# Altium schematic sheet water_system_module.SchDoc
size A4
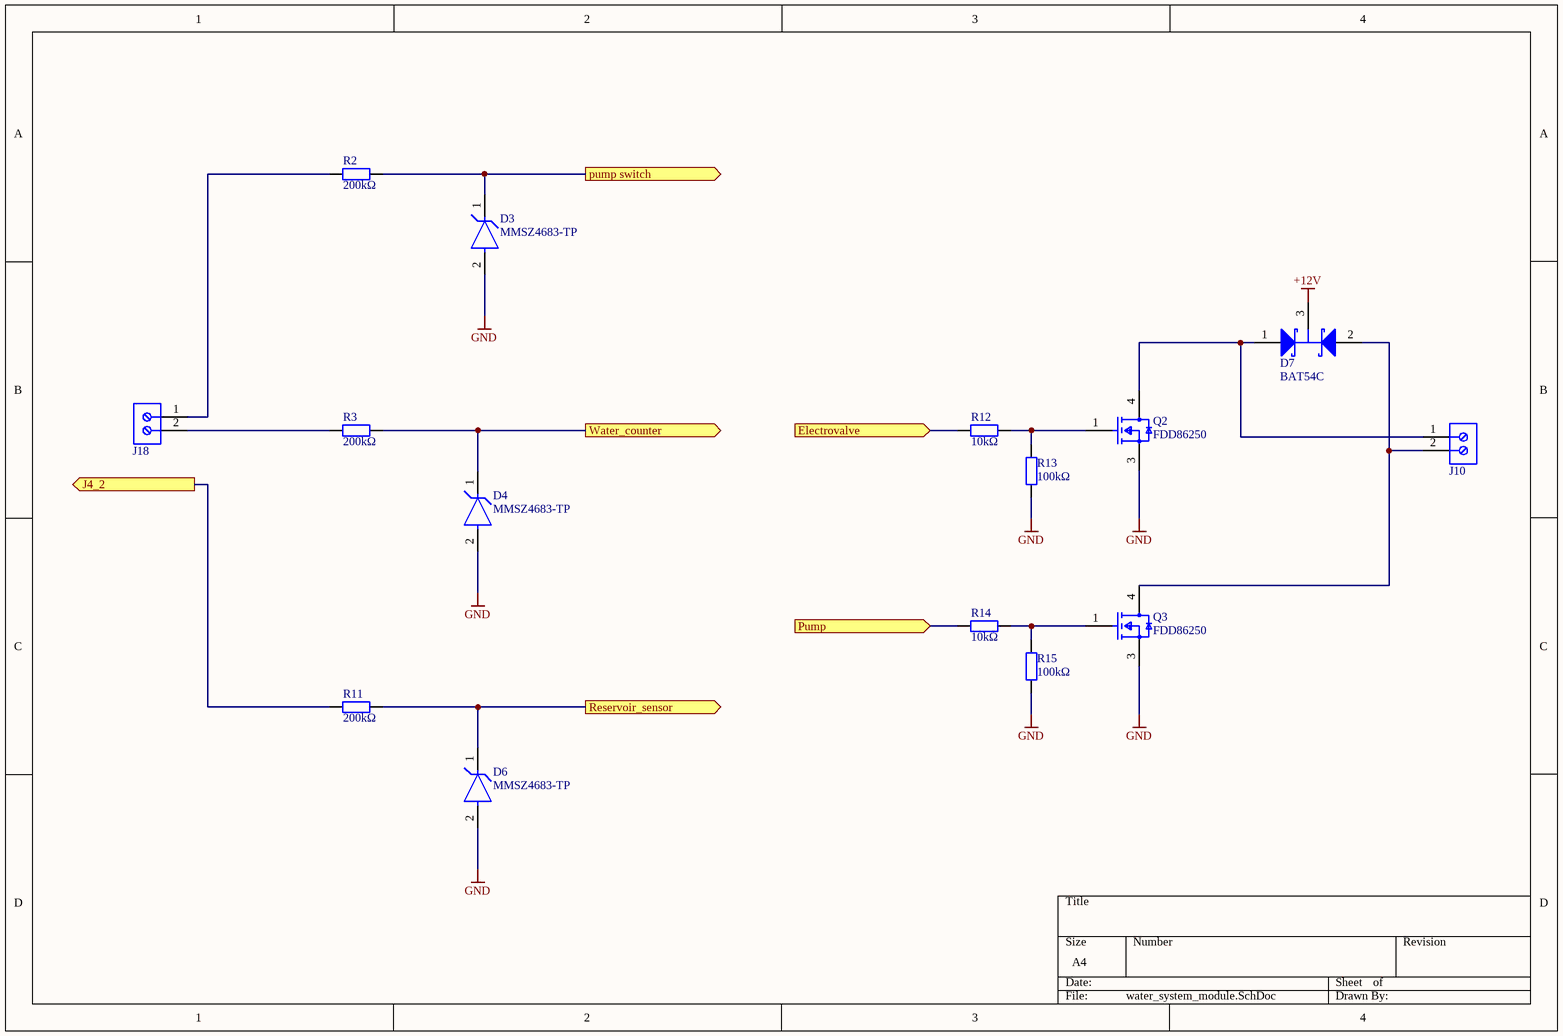
[diagram p0: water_system_module.SchDoc]

## Parts
D3  MMSZ4683-TP  [FP-SOD-123-MFG]
D4  MMSZ4683-TP  [FP-SOD-123-MFG]
D6  MMSZ4683-TP  [FP-SOD-123-MFG]
D7  BAT54C  [SOT-23]
J10  282836-2  [TECO-282836-2_V]  (value not drawn)
J18  282836-2  [TECO-282836-2_V]  (value not drawn)
Q2  FDD86250  [FP-369AS-MFG]
Q3  FDD86250  [FP-369AS-MFG]
R2  200kΩ  [RESC2013X50X30ML20T20]
R3  200kΩ  [RESC2013X50X30ML20T20]
R11  200kΩ  [RESC2013X50X30ML20T20]
R12  10kΩ  [RESC2013X50X30ML20T20]
R13  100kΩ  [RESC2013X50X30ML20T20]
R14  10kΩ  [RESC2013X50X30ML20T20]
R15  100kΩ  [RESC2013X50X30ML20T20]

## Ports
Electrovalve (in), J4_2 (out), Pump (in), pump switch (out), Reservoir_sensor (out), Water_counter (out)

## Nets
+12V: D7.3(K)
GND: D3.2(A) D4.2(A) D6.2(A) Q2.3(S) Q3.3(S) R13.2 R15.2
Electrovalve: R12.2 ; port Electrovalve
J4_2: R11.2 ; port J4_2
Pump: R14.2 ; port Pump
pump switch: D3.1(C) R2.1 ; port pump switch
Reservoir_sensor: D6.1(C) R11.1 ; port Reservoir_sensor
Water_counter: D4.1(C) R3.2 ; port Water_counter
NetD7_1: D7.1(A) J10.1 Q2.4(D)
NetD7_2: D7.2(A) J10.2 Q3.4(D)
NetJ18_1: J18.1 R2.2
NetJ18_2: J18.2 R3.1
NetQ2_1: Q2.1(G) R12.1 R13.1
NetQ3_1: Q3.1(G) R14.1 R15.1

## Library data of the parts
D3 D4 D6 = CMP-56208-000004-1: DIODE ZENER 3V 500MW SOD123; Element Configuration: Single; Voltage Tolerance: 5%; Peak Reverse Current: 800nA; Forward Voltage: 950mV; Package Quantity: 1; Packaging: Tape and Reel; Number of Pins: 2; Min Operating Temperature: -55°C; Radiation Hardening: No; Max Power Dissipation: 500mW; Power Dissipation: 500mW; Working Voltage: 3V; Max Operating Temperature: 150°C; Lead Free: Lead Free; Max Reverse Leakage Current: 800nA; Mount: Surface Mount; Zener Voltage: 3V; Tolerance: 5%
D7 = DIODE_BAT54C: Schottky Barrier Diode, 30 V, 3-Pin SOT23, RoHS, Tape and Reel; Manufacturer: NXP Semiconductors; Forward Surge Current Ifsm Max: 600mA; Pin Configuration: 1A1,2A2,3comK; Package Version: Feb-16; Forward Voltage VF Max: 800mV; SMD Marking: L43/*W1; Reverse Recovery Time trr Typ: 5ns; Forward Current If(AV): 200mA; Reel Quantity: 3000; SVHC: NoSVHC(19-Dec-2012); No. of Pins: 3; Junction Temperature Tj Max: 125degC; Common Connection: Cathode; Repetitive Reverse Voltage Vrrm Max: 30V; Operating Temperature Max: 150degC; Operating Temperature Range: -65degCto+150degC; Diode Case Style: SOT-23; Termination Type: SMD; Package Description: 3-Pin Small Outline Transistor, Body 1.3 x 2.9 mm, Pitch 0.95 mm; Package / Case: SOT-23; Diode Type: Schottky; Manufacturer URL: http://www.nxp.com/; Tape Width: 8mm; Package Reference: SOT23-3; Datasheet URL: https://datasheet.ciiva.com/33723/1668625-33723936.pdf; Datasheet Version: Rev. 5 , 10/2012; Operating Temperature Min: -65degC; Current Ifsm: 600mA; Reverse Recovery Time trr Max: 5ns; Package URL: http://www.nxp.com/documents/outline_drawing/SOT23.pdf; Forward Voltage: 800mV
J10 J18 = CMP-1684-00017-1: Female Header, Pitch 5 mm, 1 x 2 Position, Height 10 mm, Tail Length 3.5 mm, Rohs, Bulk; Manufacturer: TE Connectivity; Wire Gauge: 16-30AWG; Product Training Modules: Wire-to-BoardEurostyleTerminalBlocks; Clamp Material - Plating: Brass-NickelPlated; Voltage: 300V; Mating Orientation: HorizontalwithBoard; Current: 13.5A; Pitch: 0.197"(5.00mm); Screw Thread: M3; 3D Model: 282836-2.pdf; Other Names: 5ULV-02B / A98076; Dynamic Catalog: BuchananSeries; Number of Levels: 1; Torque - Screw: 0.68Nm(6Lb-In); Featured Product: EurostyleTerminalBlockConnectors; Positions Per Level: 2; Wire Termination: Screw-RisingCageClamp; Datasheet URL: http://www.te.com.cn/commerce/DocumentDelivery/DDEController?Action=showdoc&DocId=Catalog+Section%7F1308389_EUROSTYLE_TERMINAL_BLOCKS%7F0607%7Fpdf%7FEnglish%7FENG_CS_1308389_EUROSTYLE_TERMINAL_BLOCKS_0607.pdf%7F282836-2; Color: Green; Family: TerminalBlocks-WiretoBoard; RoHS Information: 282836-2StatementofCompliance; Standard Package: 300; Contact Material - Plating: Brass-TinPlated; Manufacturer URL: http://www.te.com; Housing Material: Polyamide(PA66),Nylon6/6; Features: Interlocking(Side); Package Description: Female Header, Pitch 5 mm, 1 x 2 Position, Height 10 mm, Tail Length 3.5 mm; Mounting Type: ThroughHole; Package Reference: THD; Packaging: Bulk; Series: Buchanan; Category: Connectors,Interconnects; Screw Material - Plating: Brass-NickelPlated
Q2 Q3 = CMP-07173-000037-1: MOSFET N-CH 150V 8A DPAK; Manufacturer: ON Semiconductor; Threshold Vgs Max: 4V; Power Dissipation: 3.1W; Gate Charge At Vgs: 23nC @ 10V; Turn On Delay Time: 11.2ns; Reverse Recovery Charge: 104nC; Max Forward Diode Voltage: 1.3V; Pulse Drain Current: 164A; Max Junction Temp: +150°C; Depletion Mode: False; Rthja Max: 40°C/W; Input Capacitace At Vds: 1585pF @ 75V; Number Of N Channels: 1; Gate To Source Voltage: 20V; Reverse Recovery Time: 71ns; Threshold Vgs Min: 2V; Typ Forward Diode Voltage: 0.78V; Transconductance: 28S; Drain To Source Resistance: 18.4mΩ; Turn Off Delay Time: 20ns; Footprint Url: https://www.onsemi.com/pub/Collateral/369AS.PDF; Automotive: No; Continuous Drain Current: 8A; Digikey Description: MOSFET N-CH 150V 8A DPAK; RoHS: TRUE; Device Class L1: Discrete Semiconductors; ComponentLink2URL: https://www.onsemi.com/pub/Collateral/FDD86250-D.pdf; Lead Free: Yes; Drain To Source Breakdown Voltage: 150V; Octopart: https://octopart.com/fdd86250-on+semiconductor-84325855; Temperature Range Low: -55°C; Device Class L3: MOSFETs; Manufacturer Part Number: FDD86250; Package: 369AS; Temperature Range High: +150°C; Category: Trans; Mouser Description: Shielded Gate PowerTrench® MOSFET, N-Channel, 150 V, 51 A, 22 mO; ComponentLink2Description: Datasheet; Temperature: -55°C to +150°C; Drain To Source Voltage: 150V; Number Of Channels: 1; Height: 2.517mm; Device Class L2: Transistors
R2 R3 R11-R15 = Res_0805: Resistor